# Altium schematic sheet Netscale48HD_Antenna_Selector.SchDoc: Antenna Selector & LED
size A3; Author: NK; CompanyName: Reichle & De-Massari; Organization: Reichle & De-Massari; Address1: Binzstrasse 32; Address2: 8620 Wetzikon; Address3: Switzerland; DocumentNumber: 2; Revision: V0.2; SheetNumber: 2; SheetTotal: 2; Organization1: Reichle & De-Massari; Size: A4; ShortDescription: Shift Register for Switches and Leds, multiplexer for Antennas
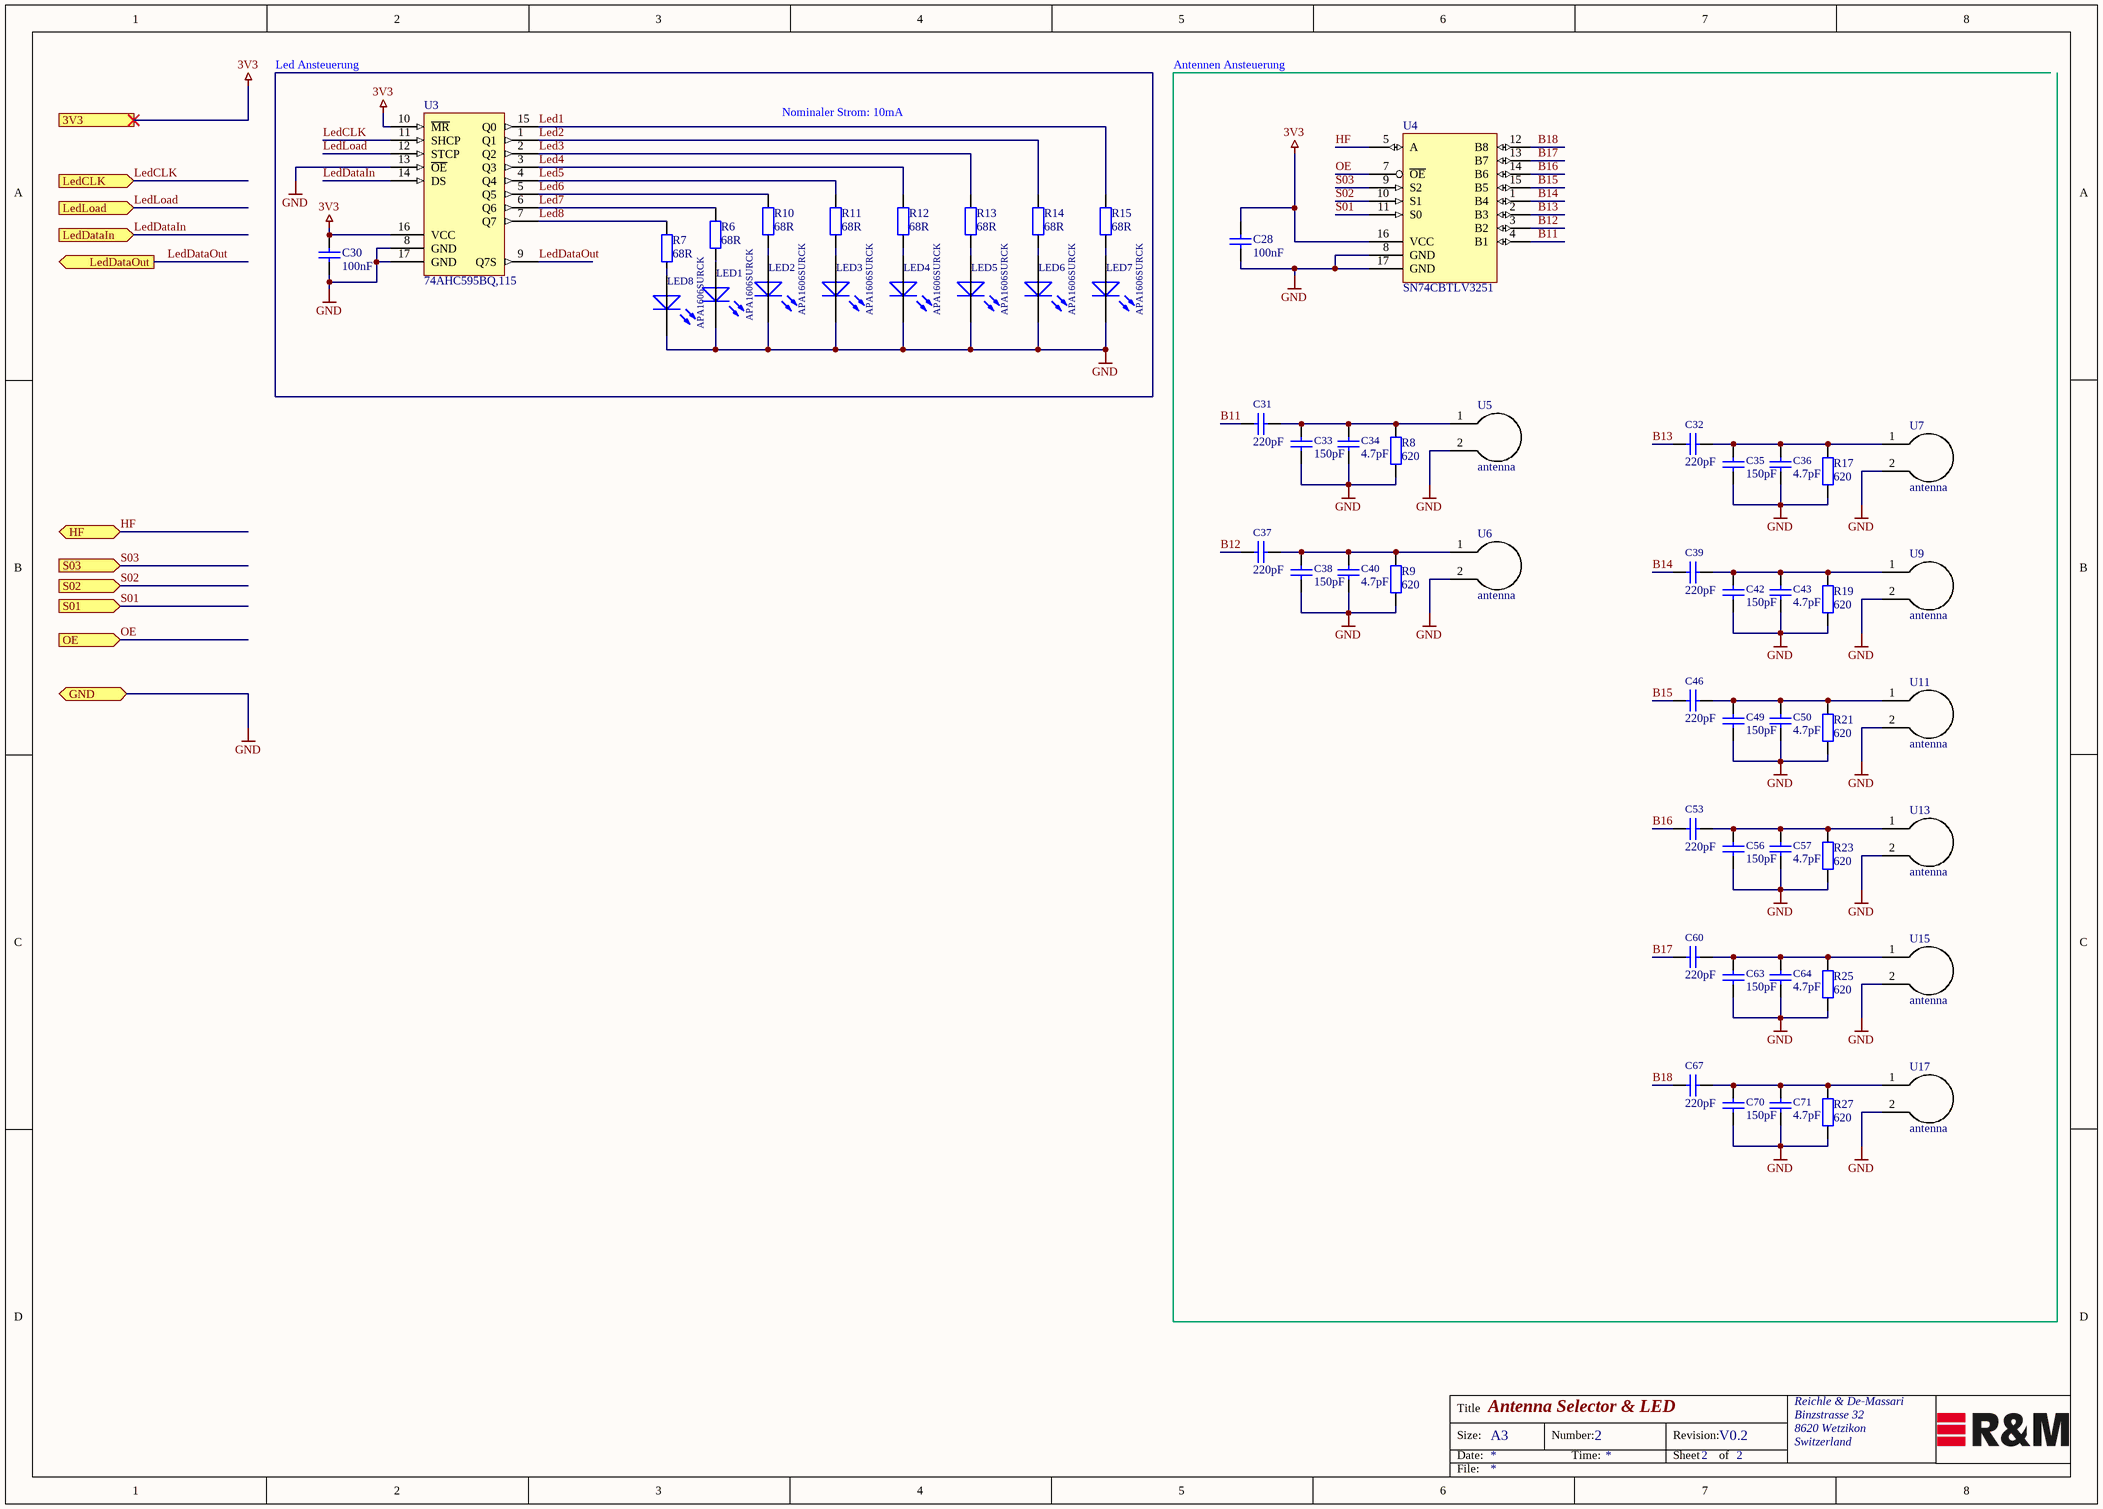
[diagram p0: Netscale48HD_Antenna_Selector.SchDoc]

## Parts
C28  value 100nF  [CAPC1005X55N]  (hidden comment: LMK105BJ104KV-F)
C30  value 100nF  [CAPC1005X55N]  (hidden comment: LMK105BJ104KV-F)
C31  value 220pF  [CAPC1005X55N]  (hidden comment: GCM1555C1H221FA16D)
C32  value 220pF  [CAPC1005X55N]  (hidden comment: GCM1555C1H221FA16D)
C33  value 150pF  [CAPC1005X55N]  (hidden comment: GRM1555C1H151FA01D)
C34  value 4.7pF  [CAPC1005X55N]  (hidden comment: GJM1555C1H4R7WB01D)
C35  value 150pF  [CAPC1005X55N]  (hidden comment: GRM1555C1H151FA01D)
C36  value 4.7pF  [CAPC1005X55N]  (hidden comment: GJM1555C1H4R7WB01D)
C37  value 220pF  [CAPC1005X55N]  (hidden comment: GCM1555C1H221FA16D)
C38  value 150pF  [CAPC1005X55N]  (hidden comment: GRM1555C1H151FA01D)
C39  value 220pF  [CAPC1005X55N]  (hidden comment: GCM1555C1H221FA16D)
C40  value 4.7pF  [CAPC1005X55N]  (hidden comment: GJM1555C1H4R7WB01D)
C42  value 150pF  [CAPC1005X55N]  (hidden comment: GRM1555C1H151FA01D)
C43  value 4.7pF  [CAPC1005X55N]  (hidden comment: GJM1555C1H4R7WB01D)
C46  value 220pF  [CAPC1005X55N]  (hidden comment: GCM1555C1H221FA16D)
C49  value 150pF  [CAPC1005X55N]  (hidden comment: GRM1555C1H151FA01D)
C50  value 4.7pF  [CAPC1005X55N]  (hidden comment: GJM1555C1H4R7WB01D)
C53  value 220pF  [CAPC1005X55N]  (hidden comment: GCM1555C1H221FA16D)
C56  value 150pF  [CAPC1005X55N]  (hidden comment: GRM1555C1H151FA01D)
C57  value 4.7pF  [CAPC1005X55N]  (hidden comment: GJM1555C1H4R7WB01D)
C60  value 220pF  [CAPC1005X55N]  (hidden comment: GCM1555C1H221FA16D)
C63  value 150pF  [CAPC1005X55N]  (hidden comment: GRM1555C1H151FA01D)
C64  value 4.7pF  [CAPC1005X55N]  (hidden comment: GJM1555C1H4R7WB01D)
C67  value 220pF  [CAPC1005X55N]  (hidden comment: GCM1555C1H221FA16D)
C70  value 150pF  [CAPC1005X55N]  (hidden comment: GRM1555C1H151FA01D)
C71  value 4.7pF  [CAPC1005X55N]  (hidden comment: GJM1555C1H4R7WB01D)
LED1  APA1606SURCK  [Kingbright_SMD_2_RWH]
LED2  APA1606SURCK  [Kingbright_SMD_2_RWH]
LED3  APA1606SURCK  [Kingbright_SMD_2_RWH]
LED4  APA1606SURCK  [Kingbright_SMD_2_RWH]
LED5  APA1606SURCK  [Kingbright_SMD_2_RWH]
LED6  APA1606SURCK  [Kingbright_SMD_2_RWH]
LED7  APA1606SURCK  [Kingbright_SMD_2_RWH]
LED8  APA1606SURCK  [Kingbright_SMD_2_RWH]
R6  value 68R  [RESC1005X40N]  (hidden comment: CRGP0402F68R)
R7  value 68R  [RESC1005X40N]  (hidden comment: CRGP0402F68R)
R8  value 620  [RESC1005X40N]  (hidden comment: ERJ-2RKF6200X)
R9  value 620  [RESC1005X40N]  (hidden comment: ERJ-2RKF6200X)
R10  value 68R  [RESC1005X40N]  (hidden comment: CRGP0402F68R)
R11  value 68R  [RESC1005X40N]  (hidden comment: CRGP0402F68R)
R12  value 68R  [RESC1005X40N]  (hidden comment: CRGP0402F68R)
R13  value 68R  [RESC1005X40N]  (hidden comment: CRGP0402F68R)
R14  value 68R  [RESC1005X40N]  (hidden comment: CRGP0402F68R)
R15  value 68R  [RESC1005X40N]  (hidden comment: CRGP0402F68R)
R17  value 620  [RESC1005X40N]  (hidden comment: ERJ-2RKF6200X)
R19  value 620  [RESC1005X40N]  (hidden comment: ERJ-2RKF6200X)
R21  value 620  [RESC1005X40N]  (hidden comment: ERJ-2RKF6200X)
R23  value 620  [RESC1005X40N]  (hidden comment: ERJ-2RKF6200X)
R25  value 620  [RESC1005X40N]  (hidden comment: ERJ-2RKF6200X)
R27  value 620  [RESC1005X40N]  (hidden comment: ERJ-2RKF6200X)
U3  74AHC595BQ,115  [NexperiaUSAInc_16-VFQFN_16_R]
U4  SN74CBTLV3251  [TexasInstruments_16-VFQFN_16_R]
U5  antenna  [antenna_1_layer]  (net tie)
U6  antenna  [antenna_1_layer]  (net tie)
U7  antenna  [antenna_1_layer]  (net tie)
U9  antenna  [antenna_1_layer]  (net tie)
U11  antenna  [antenna_1_layer]  (net tie)
U13  antenna  [antenna_1_layer]  (net tie)
U15  antenna  [antenna_1_layer]  (net tie)
U17  antenna  [antenna_1_layer]  (net tie)

## Ports
3V3, GND (bidir), HF (bidir), LedCLK (in), LedDataIn (in), LedDataOut (out), LedLoad (in), OE (in), S01 (in), S02 (in), S03 (in)

## Nets
3V3: C28.2 C30.2 U3.10(~{MR}) U3.16(VCC) U4.16(VCC) ; port 3V3
GND: C28.1 C30.1 C33.1(Pos) C34.1(Pos) C35.1(Pos) C36.1(Pos) C38.1(Pos) C40.1(Pos) C42.1(Pos) C43.1(Pos) C49.1(Pos) C50.1(Pos) C56.1(Pos) C57.1(Pos) C63.1(Pos) C64.1(Pos) C70.1(Pos) C71.1(Pos) LED1.1(K) LED2.1(K) LED3.1(K) LED4.1(K) LED5.1(K) LED6.1(K) LED7.1(K) LED8.1(K) R8.1 R9.1 R17.1 R19.1 R21.1 R23.1 R25.1 R27.1 U3.8(GND) U3.13(~{OE}) U3.17(GND) U4.8(GND) U4.17(GND) U5.2 U6.2 U7.2 U9.2 U11.2 U13.2 U15.2 U17.2 ; port GND
B11: C31.1(Pos) U4.4(B1)
B12: C37.1(Pos) U4.3(B2)
B13: C32.1(Pos) U4.2(B3)
B14: C39.1(Pos) U4.1(B4)
B15: C46.1(Pos) U4.15(B5)
B16: C53.1(Pos) U4.14(B6)
B17: C60.1(Pos) U4.13(B7)
B18: C67.1(Pos) U4.12(B8)
HF: U4.5(A) ; port HF
Led1: R15.1 U3.15(Q0)
Led2: R14.1 U3.1(Q1)
Led3: R13.1 U3.2(Q2)
Led4: R12.1 U3.3(Q3)
Led5: R11.1 U3.4(Q4)
Led6: R10.1 U3.5(Q5)
Led7: R6.1 U3.6(Q6)
Led8: R7.1 U3.7(Q7)
LedCLK: U3.11(SHCP) ; port LedCLK
LedDataIn: U3.14(DS) ; port LedDataIn
LedDataOut: U3.9(Q7S) ; port LedDataOut
LedLoad: U3.12(STCP) ; port LedLoad
OE: U4.7(~{OE}) ; port OE
S01: U4.11(S0) ; port S01
S02: U4.10(S1) ; port S02
S03: U4.9(S2) ; port S03
NetC31_2: C31.2(Neg) C33.2(Neg) C34.2(Neg) R8.2 U5.1
NetC32_2: C32.2(Neg) C35.2(Neg) C36.2(Neg) R17.2 U7.1
NetC37_2: C37.2(Neg) C38.2(Neg) C40.2(Neg) R9.2 U6.1
NetC39_2: C39.2(Neg) C42.2(Neg) C43.2(Neg) R19.2 U9.1
NetC46_2: C46.2(Neg) C49.2(Neg) C50.2(Neg) R21.2 U11.1
NetC53_2: C53.2(Neg) C56.2(Neg) C57.2(Neg) R23.2 U13.1
NetC60_2: C60.2(Neg) C63.2(Neg) C64.2(Neg) R25.2 U15.1
NetC67_2: C67.2(Neg) C70.2(Neg) C71.2(Neg) R27.2 U17.1
NetLED1_2: LED1.2(A) R6.2
NetLED2_2: LED2.2(A) R10.2
NetLED3_2: LED3.2(A) R11.2
NetLED4_2: LED4.2(A) R12.2
NetLED5_2: LED5.2(A) R13.2
NetLED6_2: LED6.2(A) R14.2
NetLED7_2: LED7.2(A) R15.2
NetLED8_2: LED8.2(A) R7.2

## Notes on the sheet
- Led Ansteuerung
- Antennen Ansteuerung
- Nominaler Strom: 10mA
- Title
- Size:
- Date:
- A3
- Number:
- Time:
- Revision:
- Sheet
- of
- File:

## Library data of the parts
C28 C30 = CMP-1033-00660-1: 0.1µF ±10% 10V Ceramic Capacitor X5R 0402 (1005 Metric); Manufacturer: Taiyo Yuden; Case-Metric: 0603; Case-EIA: 0201; Rated Voltage: 6.3 V; Tolerance: Â±10%; Max Thickness: 0.33 mm; Technology: SMT; Manufacturer PartNr: LMK105BJ104KV-F
C31 C32 C37 C39 C46 C53 C60 C67 = 706xx_R+M_InteliPhyII_KTI-00070-A.1: 220pF ±1% 50V Ceramic Capacitor C0G, NP0 0402 (1005 Metric); Manufacturer: Murata Electronics; Manufacturer PartNr: GRM033R71E122KA01D
C33 C35 C38 C42 C49 C56 C63 C70 = 706xx_R+M_InteliPhyII_KTI-00069-A.1: 150pF ±1% 50V Ceramic Capacitor C0G, NP0 0402 (1005 Metric); Manufacturer: Murata Electronics North America; Manufacturer PartNr: GRM1555C1H151FA01D
C34 C36 C40 C43 C50 C57 C64 C71 = 706xx_R+M_InteliPhyII_KTI-00023-A.1: 4.7pF ±0.05pF 50V Ceramic Capacitor C0G, NP0 0402 (1005 Metric); Manufacturer: Murata Electronics North America; Manufacturer PartNr: GJM1555C1H4R7WB01D
LED1-LED8 = 706xx_R+M_InteliPhyII_KTI-00048-A.2: Red 630nm LED Indication - Discrete 1.95V 2-SMD, No Lead; Manufacturer: Kingbright; ShortDescription: Description (used in sheet); Manufacturer PartNr: APA1606SURCK
R6 R7 R10-R15 = PassResBas0201-00055-A.2: 68 Ohms ±1% 0.125W, 1/8W Chip Resistor 0402 (1005 Metric) Pulse Withstanding Thick Film; Manufacturer: TE Connectivity Passive Product; #ClassSub: Resistor SMD; #Class: Passiv-Components; Status: nLager; Manufacturer PartNr: CRGP0402F68R
R8 R9 R17 R19 R21 R23 R25 R27 = PassResBas0201-00055-A.2: 620 Ohms ±1% 0.1W, 1/10W Chip Resistor 0402 (1005 Metric) Automotive AEC-Q200 Thick Film; Manufacturer: Panasonic Electronic Components; #ClassSub: Resistor SMD; #Class: Passiv-Components; Status: nLager; Manufacturer PartNr: ERJ-2RKF6200X
U3 = NexperiaUSAInc_74AHC595,115_16-VFQFN_16: IC 8BIT SHIFT REGISTER 16HVQFN; Manufacturer: Nexperia USA Inc.; Manufacturer PartNr: 74AHC595BQ,115
U4 = SN74CBTLV3251RGYR: Multiplexer Switch ICs Sngl-Pole Dbl-Throw Analog Switch; Manufacturer: Texas Instruments; Replaceable: no; Manufacturer PartNr: SN74CBTLV3251RGYR; ComponentLink1Description: mouser; ComponentLink1URL: https://www.mouser.ch/ProductDetail/Texas-Instruments/SN74CBTLV3251RGYR?qs=%2fha2pyFaduj0jkaZeFbDsRaCQjjoxFIhZ%2frFxSESrMpT%252bYmeDnewIw%3d%3d; Footprint/Package: VQFN-16; Supplier 1: Mouser; Supplier 2: Digi-Key; Supplier Part Number 1: 595-SN74CBTLV3251RGY; Supplier Part Number 2: 296-15105-6-ND
U5-U7 U9 U11 U13 U15 U17 = antenna: Replaceable: no; Footprint/Package: *